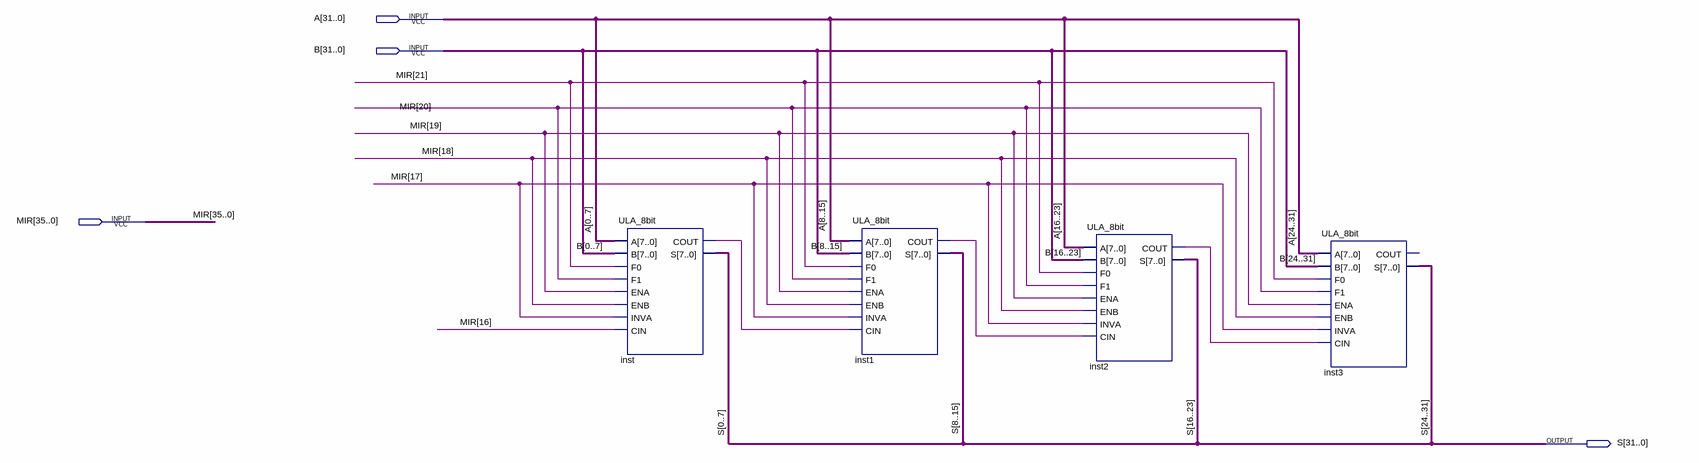
[diagram p0: schematic sheet]
// Quartus schematic ULA_32bit.bdf as structural Verilog: 4 symbols, 4 pins
module ULA_32bit (
  input  [31:0] A,
  input  [31:0] B,
  input  [35:0] MIR,
  output [31:0] S
);

  wire inst1_cout, inst2_cout, inst_cout;

  ULA_8bit inst (
    .A({A[0], A[1], A[2], A[3], A[4], A[5], A[6], A[7]}),
    .B({B[0], B[1], B[2], B[3], B[4], B[5], B[6], B[7]}), .F0(MIR[21]), .F1(MIR[20]), .ENA(MIR[19]),
    .ENB(MIR[18]), .INVA(MIR[17]), .CIN(MIR[16]), .COUT(inst_cout),
    .S({S[0], S[1], S[2], S[3], S[4], S[5], S[6], S[7]}));
  ULA_8bit inst1 (
    .A({A[8], A[9], A[10], A[11], A[12], A[13], A[14], A[15]}),
    .B({B[8], B[9], B[10], B[11], B[12], B[13], B[14], B[15]}), .F0(MIR[21]), .F1(MIR[20]), .ENA(MIR[19]),
    .ENB(MIR[18]), .INVA(MIR[17]), .CIN(inst_cout), .COUT(inst1_cout),
    .S({S[8], S[9], S[10], S[11], S[12], S[13], S[14], S[15]}));
  ULA_8bit inst2 (
    .A({A[16], A[17], A[18], A[19], A[20], A[21], A[22], A[23]}),
    .B({B[16], B[17], B[18], B[19], B[20], B[21], B[22], B[23]}), .F0(MIR[21]), .F1(MIR[20]), .ENA(MIR[19]),
    .ENB(MIR[18]), .INVA(MIR[17]), .CIN(inst1_cout), .COUT(inst2_cout),
    .S({S[16], S[17], S[18], S[19], S[20], S[21], S[22], S[23]}));
  ULA_8bit inst3 (
    .A({A[24], A[25], A[26], A[27], A[28], A[29], A[30], A[31]}),
    .B({B[24], B[25], B[26], B[27], B[28], B[29], B[30], B[31]}), .F0(MIR[21]), .F1(MIR[20]), .ENA(MIR[19]),
    .ENB(MIR[18]), .INVA(MIR[17]), .CIN(inst2_cout),
    .S({S[24], S[25], S[26], S[27], S[28], S[29], S[30], S[31]}));  // open: COUT
endmodule
